# EAGLE design ESP_PZEM_v2.1 (EAGLE 8.5.2)
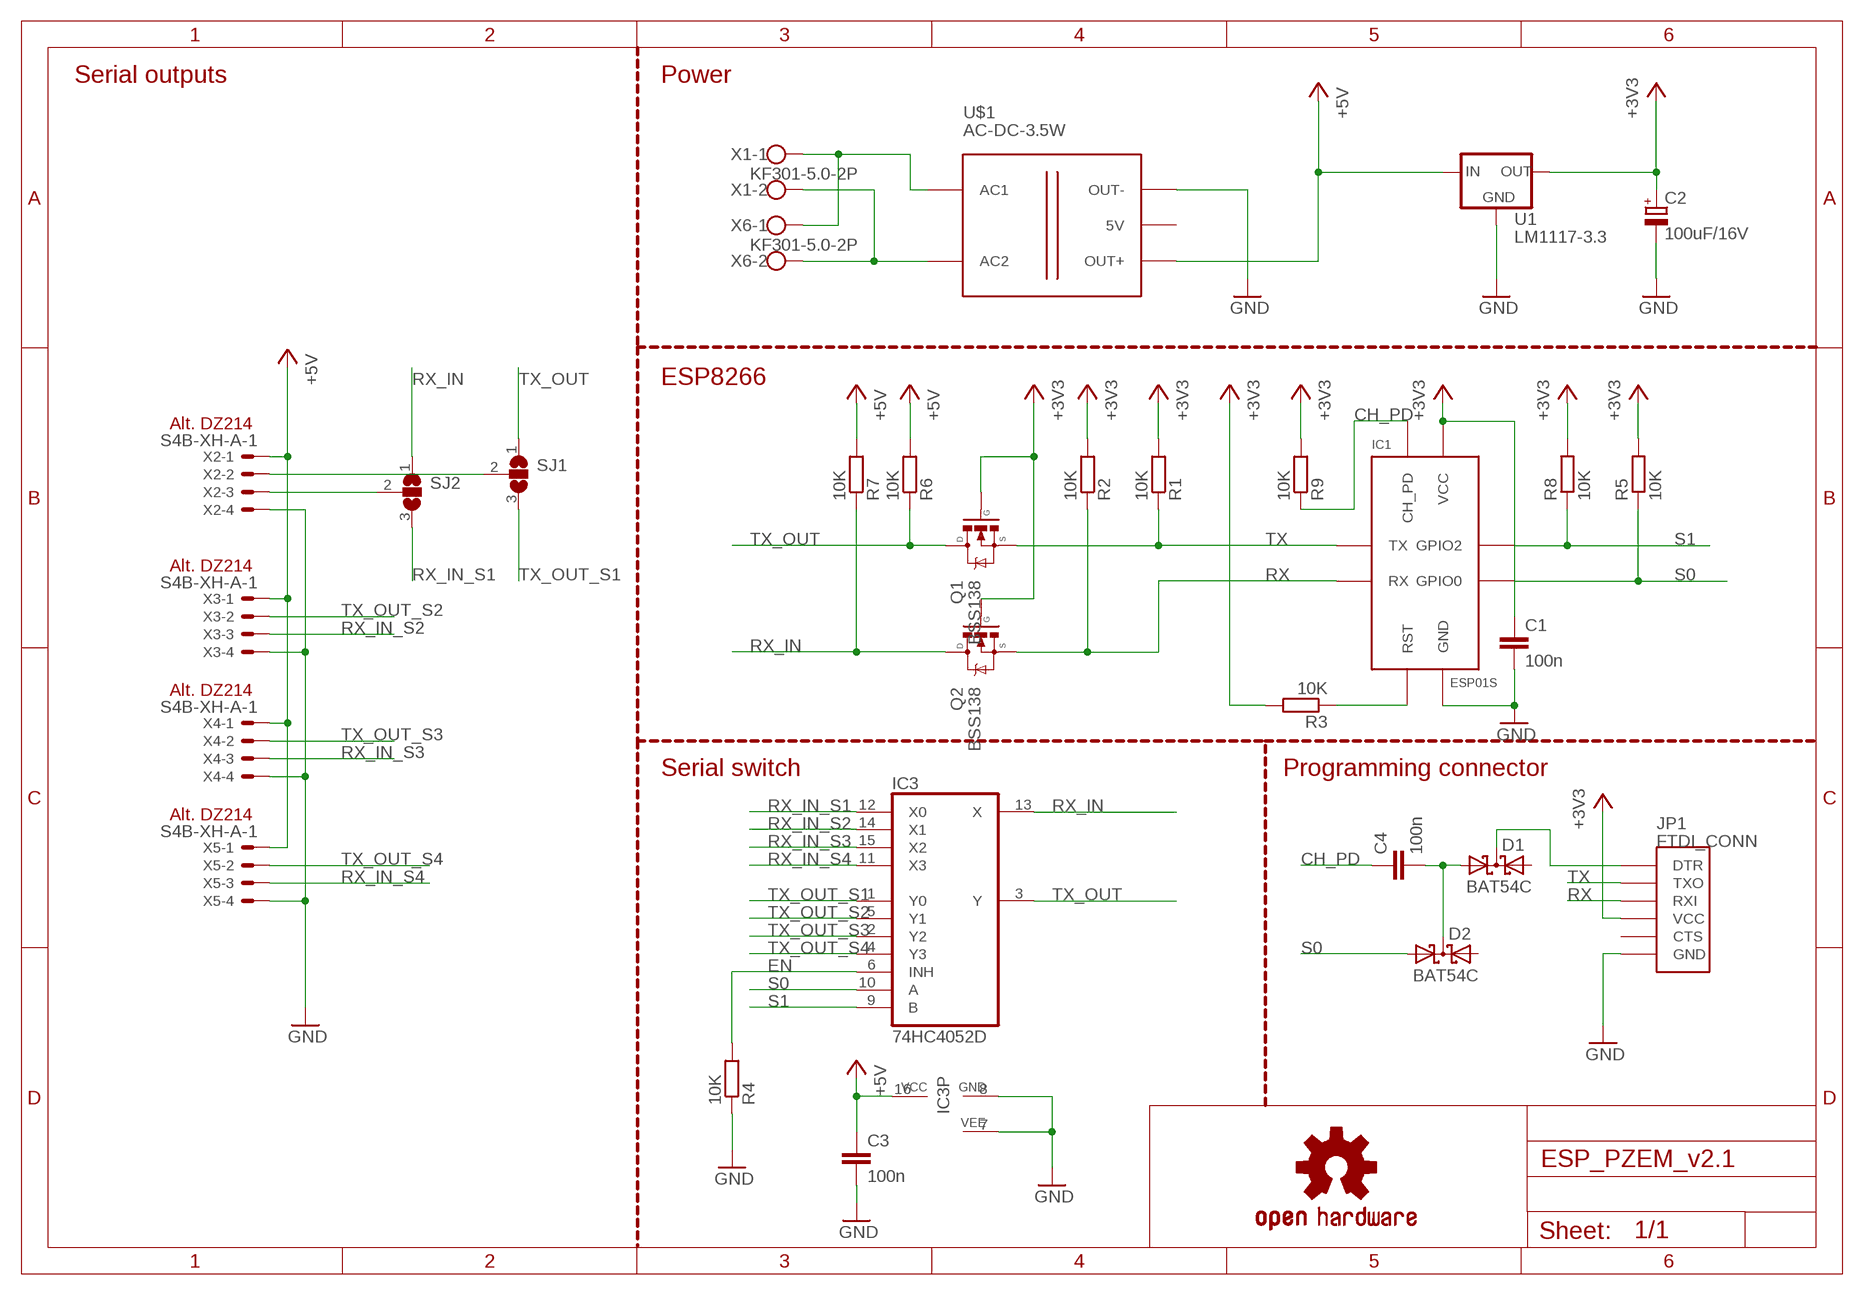
[diagram p0: schematic, sheet 1]

## Parts
C1  100n  C-EUC0805  [C0805]
C2  100uF/16V  CPOL-EUSMCB  [SMC_B]
C3  100n  C-EUC0805  [C0805]
C4  100n  C-EUC0805  [C0805]
D1  BAT54C  [SOT23]
D2  BAT54C  [SOT23]
IC1  ESP01S  ESP8266-01  [ESP-01]
IC3  74HC4052D  4052D  [SO16]
JP1  FTDI_CONN  [FTDI]
LOGO1  OSHW-LOGOL  [OSHW-LOGO-L]
Q1  BSS138  [SOT23]
Q2  BSS138  [SOT23]
R1  10K  R-EU_R0805  [R0805]
R2  10K  R-EU_R0805  [R0805]
R3  10K  R-EU_R0805  [R0805]
R4  10K  R-EU_R0805  [R0805]
R5  10K  R-EU_R0805  [R0805]
R6  10K  R-EU_R0805  [R0805]
R7  10K  R-EU_R0805  [R0805]
R8  10K  R-EU_R0805  [R0805]
R9  10K  R-EU_R0805  [R0805]
SJ1  SJ2W  [SJ_2]
SJ2  SJ2W  [SJ_2]
U1  LM1117-3.3  [SOT223]
U$1  AC-DC-3.5W  [AC-DC-3.5W]
X1  KF301-5.0-2P  [KF301-5.0-2P]
X2  S4B-XH-A-1  JST-XH-04-PIN-RIGHT-ANGLE  [JST-XH-04-PACKAGE-RIGHT]
X3  S4B-XH-A-1  JST-XH-04-PIN-RIGHT-ANGLE  [JST-XH-04-PACKAGE-RIGHT]
X4  S4B-XH-A-1  JST-XH-04-PIN-RIGHT-ANGLE  [JST-XH-04-PACKAGE-RIGHT]
X5  S4B-XH-A-1  JST-XH-04-PIN-RIGHT-ANGLE  [JST-XH-04-PACKAGE-RIGHT]
X6  KF301-5.0-2P  [KF301-5.0-2P]

## Nets
+3V3: C1.1 C2.+ IC1.VCC JP1.P$4(VCC) Q1.1(G) Q2.1(G) R1.2 R2.2 R3.2 R5.2 R8.2 R9.2 U1.2(OUT) U1.4(OUT)
+5V: C3.1 IC3.16(VCC) R6.2 R7.2 U1.3(IN) U$1.J2.3(OUT+) X2.1 X3.1 X4.1 X5.1
CH_PD: C4.1 IC1.CH_PD R9.1
EN: IC3.6(INH) R4.2
GND: C1.2 C2.- C3.2 IC1.GND IC3.7(VEE) IC3.8(GND) JP1.P$6(GND) R4.1 U1.1(GND) U$1.J2.1(OUT-) X2.4 X3.4 X4.4 X5.4
L: U$1.J1.1(AC1) X1.1 X6.1
N: U$1.J1.2(AC2) X1.2 X6.2
N$1: IC1.RST R3.1
N$2: C4.2 D1.1(A1) D2.3(CC)
N$4: SJ1.2 X2.2
N$5: SJ2.2 X2.3
N$8: D1.3(CC) JP1.P$1(DTR)
RX: IC1.RX JP1.P$3(RXI) Q2.2(S) R2.1
RX_IN: IC3.13(X) Q2.3(D) R7.1 SJ2.1
RX_IN_S1: IC3.12(X0) SJ2.3
RX_IN_S2: IC3.14(X1) X3.3
RX_IN_S3: IC3.15(X2) X4.3
RX_IN_S4: IC3.11(X3) X5.3
S0: D2.1(A1) IC1.GPIO0 IC3.10(A) R5.1
S1: IC1.GPIO2 IC3.9(B) R8.1
TX: IC1.TX JP1.P$2(TXO) Q1.2(S) R1.1
TX_OUT: IC3.3(Y) Q1.3(D) R6.1 SJ1.1
TX_OUT_S1: IC3.1(Y0) SJ1.3
TX_OUT_S2: IC3.5(Y1) X3.2
TX_OUT_S3: IC3.2(Y2) X4.2
TX_OUT_S4: IC3.4(Y3) X5.2
Unconnected: D1.2(A2) D2.2(A2) JP1.P$5(CTS) U$1.J2.2(5V)

## Notes on the sheet
- Serial outputs | Power
- ESP8266
- Alt. DZ214
- Alt. DZ214
- Alt. DZ214
- Serial switch | Programming connector
- Alt. DZ214

## Library data of the parts
C1 C3 C4 = rcl:C-EU: CAPACITOR, European symbol; SPICEPREFIX: C
C2 = rcl:CPOL-EU: POLARIZED CAPACITOR, European symbol; SPICEPREFIX: C
D1 D2 = diode:BAT54C: Schottky Diodes Source: Fairchild .. BAT54.pdf
IC1 = my-ESP8266:ESP8266-01
IC3 = 40xx:4052: Dual 4-channel ANALOG MULTIPLEXER
JP1 = my-connectors:FTDI_CONN: Connector which mates to FTDI basic or FTDI cable.
LOGO1 = SparkFun-Aesthetics:OSHW-LOGO: Open-Source Hardware (OSHW) Logo This logo indicates the piece of hardware it is found on incorporates a OSHW license and/or adheres to the definition of open source hardware found here: http://freedomdefined.org/OSHW
Q1 Q2 = my-mosfet:BSS138: N-Channel Enhancement Mode Transistor
R1-R9 = rcl:R-EU_: RESISTOR, European symbol; SPICEPREFIX: R
SJ1 SJ2 = jumper:SJ2W: SMD solder JUMPER
U1 = my-power:LM1117-*: LDO regulator
U$1 = diy-modules:AC-DC-3.5W: AC/DC 3.5W Converter More details available here: https://www.itead.cc/wiki/AC-DC_Power_Module_5V_700mA Click here to find device on ebay.com <http://www.ebay.com/sch/ac+dc+3.5w+buck+step>
X1 X6 = my-connectors:KF301-5.0-2P: Screw terminal
X2-X5 = con-JST XH Connectors v1-0:JST-XH-04-PIN: JST XH Connector 2 Pin Wire to board connector. Pitch: 2,54 mm, (0.100") Number of pins: 4 Created by Rembrandt Electronics www.rembrandtelectronics.com

## Board
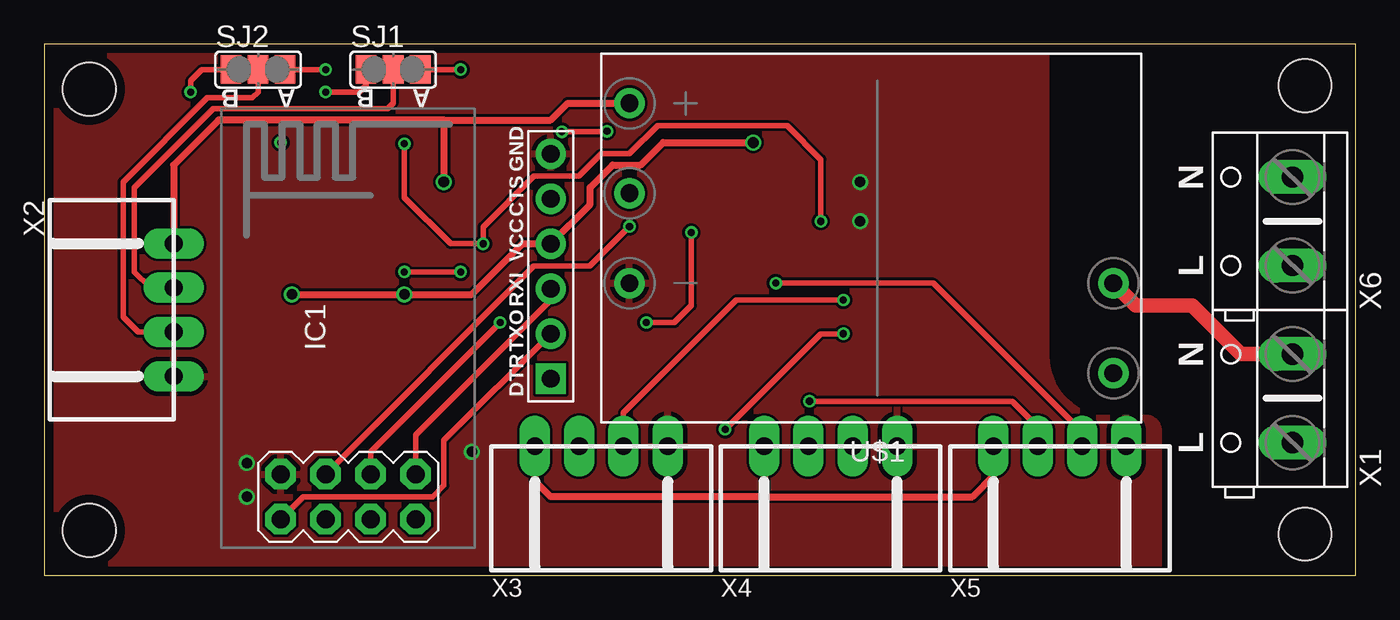
[diagram p1: board, top side]
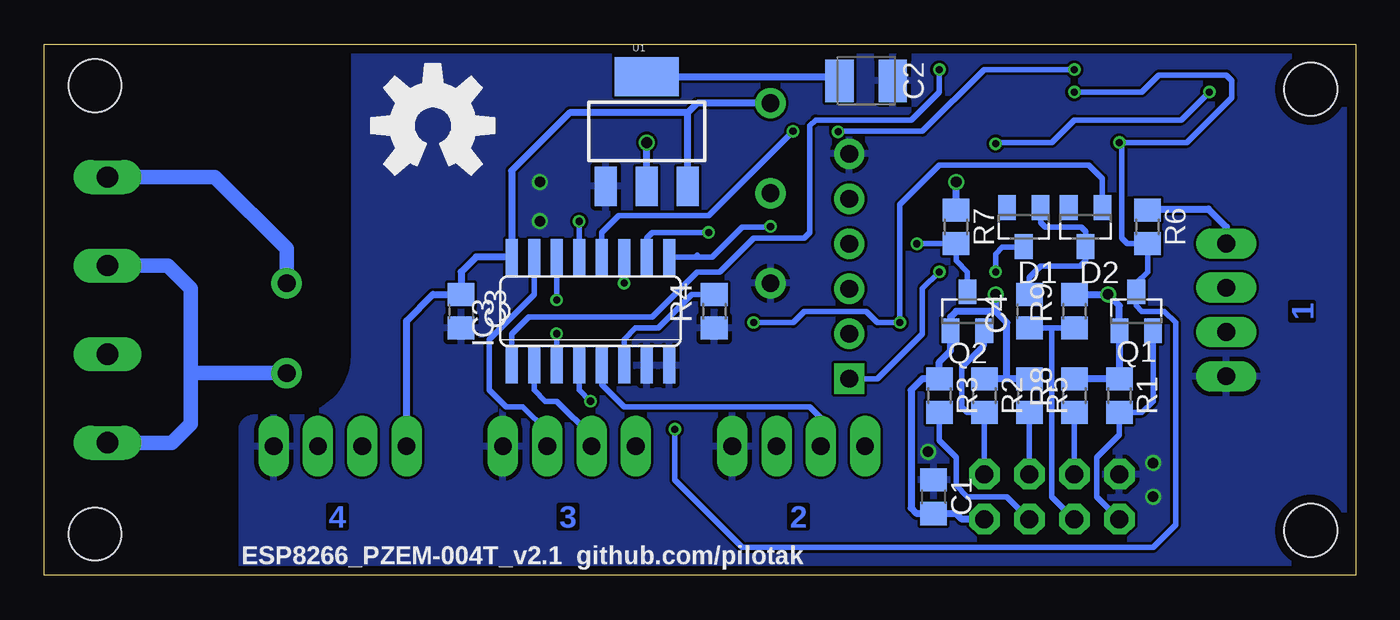
[diagram p2: board, bottom side, seen from below]

Size 74 x 30 mm. Coordinates in mm from the lower left corner, seen from the top.
Outline: 0,0 74,0 74,30 0,30 0,0
Copper layers (1*16): Top 0.035mm / dielectric 1.6mm / Bottom 0.035mm
Design rules "Elecrow_2-layer_PCB_eagle_rule *": minimum track width 6mil, minimum drill 12mil, track to track 6mil, track to pad 6mil, pad to pad 6mil, via to via 8mil, smd to smd 0mil, copper to edge 20mil, drill to drill 10mil, minimum pad ring 14mil, minimum via ring 6mil, stop-mask expansion 0mil, vias tented up to drill 100mil, thermal gap 10mil
Holes 3 mm at 2.54,27.46 2.54,2.54 71.14,27.66 71.14,2.34

### Footprints (pad centres in the part's own frame; a part is rotated, then mirrored left to right if it is on the bottom)
C0805 = smd 1.3 x 1.5: 1 -0.95,0; 2 0.95,0
SMC_B = smd 1.6 x 2.4: + -1.5,0; - 1.5,0
SOT23 = smd 1 x 1.4: 1 -0.95,-1.1; 2 0.95,-1.1; 3 0,1.1
ESP-01 = drill 1.016 octagon: CH_PD -10.795,1.27; GND -8.255,3.81; GPIO0 -8.255,-1.27; GPIO2 -8.255,1.27; RST -10.795,-1.27; RX -8.255,-3.81; TX -10.795,3.81; VCC -10.795,-3.81
SO16 = smd 0.66 x 2.032: 1 -4.445,-3.073; 2 -3.175,-3.073; 3 -1.905,-3.073; 4 -0.635,-3.073; 5 0.635,-3.073; 6 1.905,-3.073; 7 3.175,-3.073; 8 4.445,-3.073; 9 4.445,3.073; 10 3.175,3.073; 11 1.905,3.073; 12 0.635,3.073; 13 -0.635,3.073; 14 -1.905,3.073; 15 -3.175,3.073; 16 -4.445,3.073
FTDI = drill 1 pad 1.651 square: P$1 -6.35,0 | drill 1 pad 1.651: P$2 -3.81,0; P$3 -1.27,0; P$4 1.27,0; P$5 3.81,0; P$6 6.35,0
R0805 = smd 1.3 x 1.5: 1 -0.95,0; 2 0.95,0
SJ_2 = smd 1.168 x 1.6: 1 -1.524,0; 2 0,0; 3 1.524,0
SOT223 = smd 1.219 x 2.235: 1 -2.311,-3.099; 2 0,-3.099; 3 2.311,-3.099 | smd 3.6 x 2.2: 4 0,3.099
AC-DC-3.5W = drill 1: J1.1 -13.335,7.62; J1.2 -13.335,2.54; J2.1 13.97,2.54; J2.2 13.97,-2.54; J2.3 13.97,-7.62
KF301-5.0-2P = drill 1.2 long: 1 -2.5,0; 2 2.5,0
JST-XH-04-PACKAGE-RIGHT = drill 1 long: 1 -3.75,0; 2 -1.25,0; 3 1.25,0; 4 3.75,0

### Placement (x,y rotation side)
C1  23.81,4.45 90 bottom
C2  27.62,27.94 0 bottom
C3  50.48,14.92 270 bottom
C4  18.41,14.92 90 bottom
D1  18.73,19.68 180 bottom
D2  15.24,19.68 180 bottom
IC1  17.14,13.97 90 top
IC3  43.18,14.92 0 bottom
JP1  28.57,17.46 90 top
LOGO1  52.07,25.4 0 bottom
Q1  12.38,14.92 0 bottom
Q2  21.91,14.92 0 bottom
R1  13.34,10.16 90 bottom
R2  20.95,10.16 90 bottom
R3  23.5,10.16 90 bottom
R4  36.2,14.92 90 bottom
R5  18.41,10.16 90 bottom
R6  11.75,19.68 90 bottom
R7  22.54,19.68 90 bottom
R8  15.88,10.16 90 bottom
R9  15.88,14.92 90 bottom
SJ1  19.68,28.57 0 top
SJ2  12.06,28.57 0 top
U1  40.01,25.08 0 bottom
U$1  46.99,19.05 180 top
X1  70.44,10 90 top
X2  7.3,15 270 top
X3  31.43,7.3 0 top
X4  44.37,7.3 0 top
X5  57.31,7.3 0 top
X6  70.44,20 90 top

### Tracks (layer width: path | path; a pad name or v marks a point on that pad's centre or on a via)
+3V3  (via drill 0.6)
  Top 0.406: v13.97,15.88 v20.32,15.88 24.13,15.88 26.99,18.73 JP1.P$4 30.8,20.95 30.8,21.91 32.07,23.18 33.66,23.18 34.92,24.45 v40.01,24.45
  Bottom 0.406: IC1.VCC 22.23,3.17 22.54,3.49 C1.1 24.77,3.5 25.08,3.81 25.08,10.48 24.45,11.11 R3.2 23.5,12.06 22.86,12.7 Q2.1 22.86,14.61 22.54,14.92 20.32,14.92 | R8.2 R1.2 Q1.1 13.33,15.24 v13.97,15.88 v13.97,15.87 R9.2 | U1.2 v40.01,24.45 | R5.2 19.68,11.11 | 19.68,11.11 R2.2 | 20.32,14.92 v20.32,15.88 | 19.68,11.11 19.68,14.29 20.32,14.92 | U1.4 29.36,28.18 C2.+
+5V  (via drill 0.6)
  Top 0.406: X3.1 27.68,5.34 28.57,4.45 40.63,4.45 | 40.63,4.45 52.39,4.45 53.56,5.62 X5.1 | X4.1 40.62,4.46 40.63,4.45 | X2.1 7.3,23.18 9.84,25.72 22.56,25.72 | 22.56,25.72 28.57,25.72 29.53,26.67 U$1.J2.3 | v22.54,22.23 22.56,22.23 22.56,25.72
  Bottom 0.406: U1.3 37.69,26.12 | X2.1 7.3,19.68 8.32,20.7 11.68,20.7 R6.2 | R7.2 v22.54,22.23 | U$1.J2.3 37.15,26.67 37.69,26.12 | X5.1 53.56,14.39 52.07,15.87 C3.1 50.48,17.14 49.63,18 IC3.16 47.62,22.86 44.36,26.12 37.69,26.12
CH_PD
  Bottom 0.305: IC1.CH_PD 17.14,4.45 17.14,13.89 17.14,13.91 17.14,13.97 | C4.1 17.14,13.97 | 17.14,13.97 R9.1
EN
  Bottom 0.305: IC3.6 41.27,13.34 40.64,13.97 39.37,13.97 37.47,15.88 R4.2
GND  (via drill 0.6)
  other vias: 24.13,6.99 11.43,4.45 11.43,6.35 46.04,20 46.04,22.23
  pour Bottom: 0,0 0,30 56.52,30 56.52,12.39 arc90 60.02,8.89 62.16,8.89 arc-90 62.87,8.19 62.87,0
  pour Top: 0,0 0,30.48 56.52,30.48 56.52,12.39 arc90 60.02,8.89 62.16,8.89 arc-90 62.87,8.19 62.87,0
L
  Bottom 0.813: 60.82,11.43 U$1.J1.1 | 60.83,11.44 60.82,11.43 | X6.1 67.03,17.5 65.72,16.19 65.72,11.43 | 65.72,11.43 65.72,8.57 66.8,7.5 X1.1 | 60.82,11.43 65.72,11.43
N
  Top 0.813: X1.2 67.51,12.5 64.77,15.24 61.59,15.24 U$1.J1.2
  Bottom 0.813: X6.2 64.37,22.5 60.33,18.45 U$1.J1.2
N$1
  Bottom 0.305: IC1.RST 19.68,4.45 21.91,4.45 22.54,5.08 22.54,6.67 23.5,7.62 R3.1
N$2
  Bottom 0.305: C4.2 18.41,16.83 17.78,17.46 15.55,17.46 15.24,17.78 D2.3 15.24,19.43 15.49,19.68 17.53,19.68 17.78,19.94 D1.1
N$4
  Top 0.305: SJ1.2 19.68,26.67 19.37,26.35 9.53,26.35 5.08,21.91 5.08,17.14 5.97,16.25 X2.2
N$5
  Top 0.305: SJ2.2 12.06,27.3 11.75,26.99 9.21,26.99 4.45,22.23 4.45,14.61 5.3,13.75 X2.3
N$8  (via drill 0.4)
  Top 0.305: v20.32,17.14 v23.5,17.14
  Bottom 0.305: v23.5,17.14 24.45,16.19 24.45,13.65 26.99,11.11 JP1.P$1 | D1.3 18.78,18.54 19.94,18.54 20.32,18.16 v20.32,17.14
RX
  Top 0.305: JP1.P$3 28.57,15.56 20.95,7.94 IC1.RX
  Bottom 0.305: IC1.RX R2.1 21.91,9.21 22.23,9.53 22.23,11.75 20.95,13.02 20.96,13.02 Q2.2
RX_IN  (via drill 0.4)
  Top 0.305: SJ2.1 8.89,28.57 8.26,27.94 v8.26,27.3 | v43.81,20 43.81,23.5 41.91,25.4 34.61,25.4 33.02,23.81 31.43,23.81 30.16,22.54 27.62,22.54 24.77,19.68 v24.77,18.73 22.92,18.73 20.32,21.34 v20.32,24.38
  Bottom 0.305: Q2.3 21.91,17.14 22.54,17.78 R7.1 v24.76,18.73 v24.77,18.73 | v8.26,27.3 9.84,25.72 15.88,25.72 17.14,24.45 20.26,24.45 v20.32,24.38 | IC3.13 v43.81,20
RX_IN_S1  (via drill 0.4)
  Top 0.305: SJ2.3 v15.88,28.57 | v29.21,25.06 31.77,25.06 v31.75,25.08
  Bottom 0.305: v15.88,28.57 20.95,28.57 24.45,25.08 29.21,25.08 v29.21,25.06 | IC3.12 42.55,19.37 41.59,20.32 36.51,20.32 v31.75,25.08
RX_IN_S2  (via drill 0.4)
  Top 0.305: X3.3 32.68,9.19 39.05,15.56 v45.09,15.56
  Bottom 0.305: IC3.14 v45.09,15.56
RX_IN_S3
  Bottom 0.305: X4.3 45.62,8.16 46.99,9.53 47.94,9.53 48.9,10.48 48.9,13.34 46.35,15.88 IC3.15
RX_IN_S4  (via drill 0.4)
  Top 0.305: v41.27,16.51 50.16,16.51 58.56,8.12 X5.3
  Bottom 0.305: IC3.11 v41.27,16.51
S0  (via drill 0.4)
  Top 0.305: v33.97,14.29 35.56,14.29 36.51,15.24 v36.51,19.37 | IC1.GPIO0 18.41,6.99 v25.72,14.29
  Bottom 0.305: IC3.10 40.01,19.05 39.69,19.37 v36.51,19.37 | IC1.GPIO0 R5.1 | v33.97,14.29 31.75,14.29 31.11,14.92 27.62,14.92 26.99,14.29 v25.72,14.29 25.72,20.95 23.5,23.18 15.05,23.18 14.29,22.42 D2.1
S1  (via drill 0.4)
  Top 0.305: IC1.GPIO2 27.62,17.46 30.77,17.46 v33.02,19.71
  Bottom 0.305: IC3.9 37.25,18 | 37.25,18 37.15,18.1 | R8.1 IC1.GPIO2 | 37.25,18 36.3,18 34.61,19.68 33.02,19.68 v33.02,19.71
TX
  Top 0.305: IC1.TX 14.61,4.45 21.91,4.45 22.54,5.08 22.54,7.62 JP1.P$2
  Bottom 0.305: IC1.TX 14.61,4.45 14.61,6.67 13.34,7.94 R1.1 12.06,9.21 11.43,9.84 Q1.2
TX_OUT  (via drill 0.4)
  Top 0.305: v45.09,13.65 43.81,13.65 v38.42,8.26 | v15.88,27.3 17.78,27.3 18.16,27.69 SJ1.1
  Bottom 0.305: IC3.3 v45.09,13.65 | v38.42,8.26 38.42,5.4 34.61,1.59 11.43,1.59 10.16,2.86 10.16,14.29 10.79,14.92 12.06,14.92 12.38,15.24 Q1.3 12.38,16.51 11.75,17.14 R6.1 12.89,18.73 13.21,19.05 13.21,24.32 v13.34,24.45 9.53,24.45 6.99,26.99 6.99,27.94 7.3,28.26 11.11,28.26 12.06,27.3 v15.88,27.3
TX_OUT_S1  (via drill 0.4)
  Top 0.305: SJ1.3 v23.5,28.57
  Bottom 0.305: IC3.1 47.62,13.65 46.67,14.61 39.69,14.61 37.15,17.14 35.88,17.14 33.97,19.05 31.11,19.05 30.8,19.37 30.8,25.4 30.48,25.72 25.08,25.72 23.5,27.3 v23.5,28.57
TX_OUT_S2
  Bottom 0.305: X3.2 30.18,8.91 30.8,9.53 41.27,9.53 42.55,10.79 IC3.5
TX_OUT_S3
  Bottom 0.305: X4.2 43.12,7.88 45.09,9.84 45.72,9.84 46.35,10.48 IC3.2
TX_OUT_S4  (via drill 0.4)
  Top 0.305: v43.18,9.84 54.61,9.84 56.06,8.39 X5.2
  Bottom 0.305: IC3.4 43.81,10.48 v43.18,9.84

### Text on the board
Bottom: 1 | 2 | 3 | 4
tPlace: B | A | B | A | N | L | N | L
bPlace: ESP8266_PZEM-004T_v2.1 github.com/pilotak
bStop: 1 | 2 | 3 | 4